# EAGLE schematic Lilypad buffered (EAGLE 6.1)
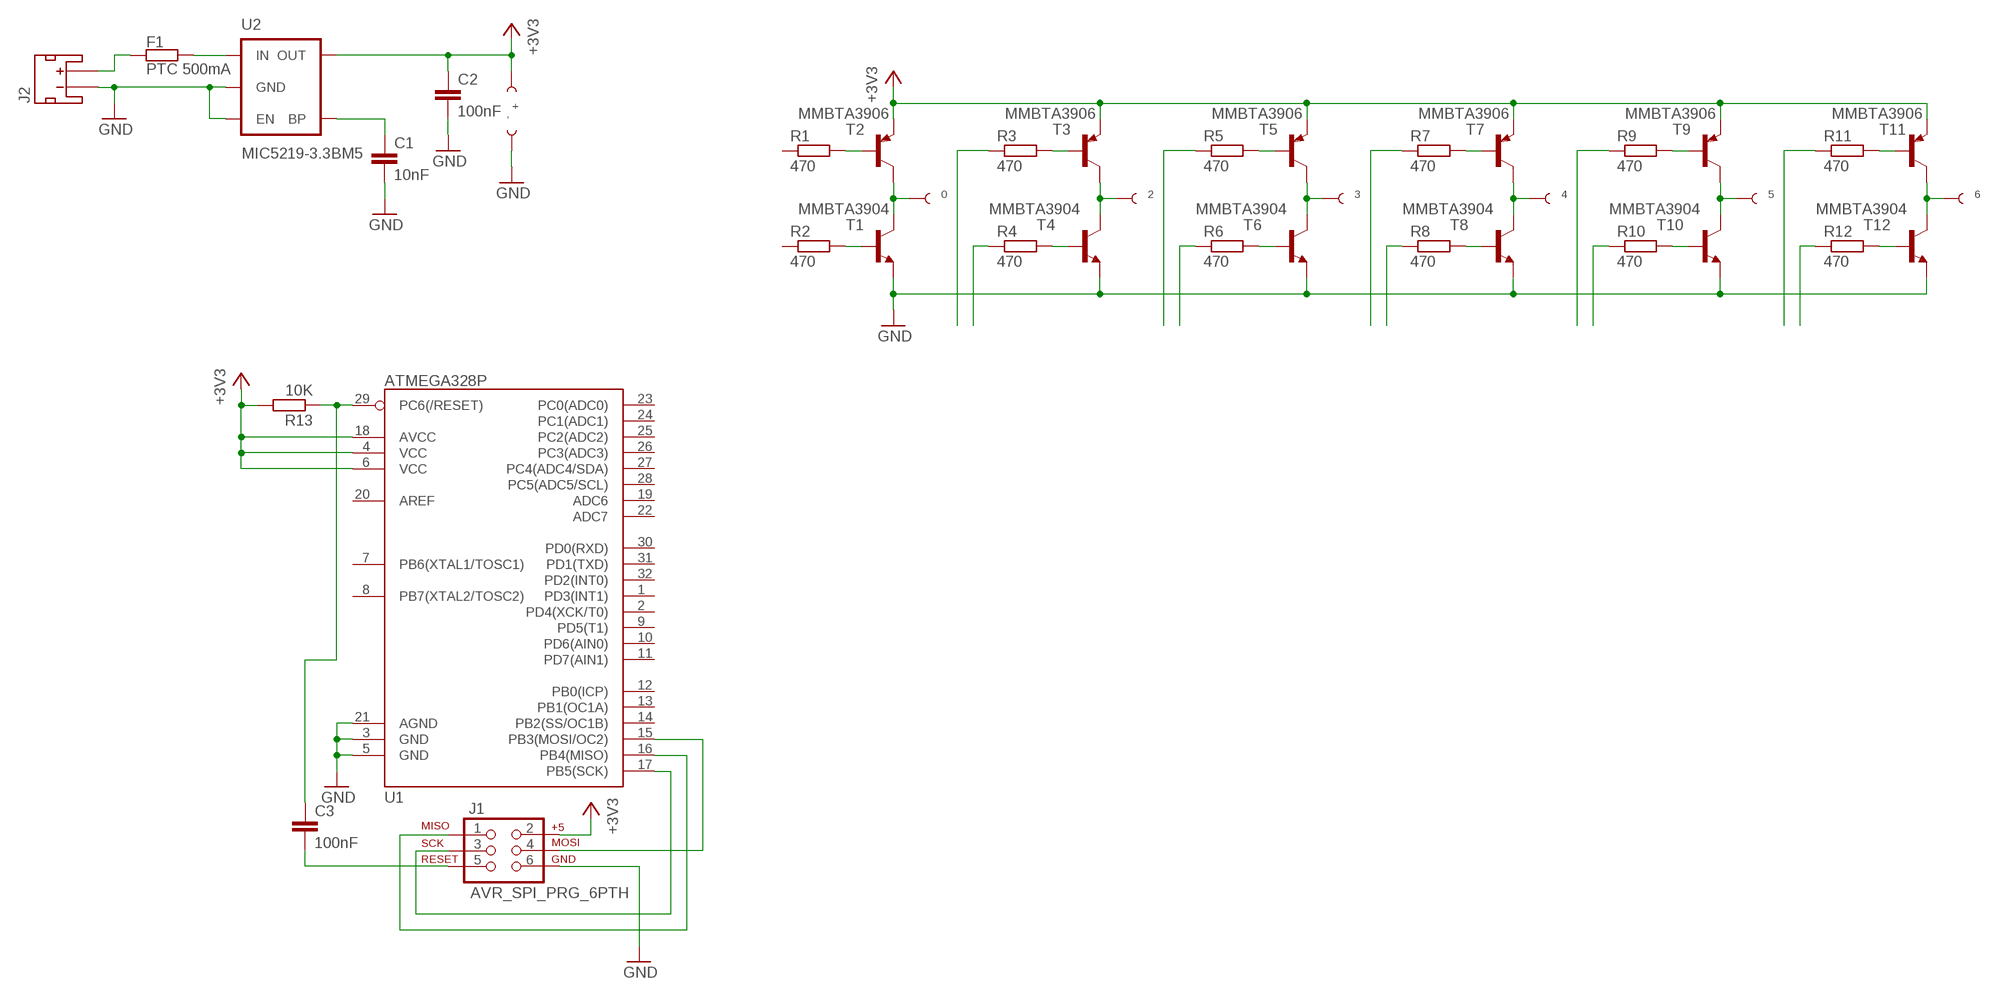
[diagram p0: schematic, sheet 1]

## Parts
C1  10nF  C-EUC0805K  [C0805K]
C2  100nF  C-EUC0805K  [C0805K]
C3  100nF  C-EUC0805K  [C0805K]
F1  PTC 500mA  RESISTENCIA-SMD-2012  [SMD-2012]
J1  AVR_SPI_PRG_6PTH  [2X3]
J2  JST_2MM_MALE  [JST-2-SMD]
R1  470  R-EU_R0603  [R0603]
R2  470  R-EU_R0603  [R0603]
R3  470  R-EU_R0603  [R0603]
R4  470  R-EU_R0603  [R0603]
R5  470  R-EU_R0603  [R0603]
R6  470  R-EU_R0603  [R0603]
R7  470  R-EU_R0603  [R0603]
R8  470  R-EU_R0603  [R0603]
R9  470  R-EU_R0603  [R0603]
R10  470  R-EU_R0603  [R0603]
R11  470  R-EU_R0603  [R0603]
R12  470  R-EU_R0603  [R0603]
R13  10K  R-EU_R0603  [R0603]
T1  MMBTA3904  MMBT3904LT1-NPN-SOT23-BEC  [SOT23-BEC]
T2  MMBTA3906  MMBT3906LT1-PNP-SOT23-BEC  [SOT23-BEC]
T3  MMBTA3906  MMBT3906LT1-PNP-SOT23-BEC  [SOT23-BEC]
T4  MMBTA3904  MMBT3904LT1-NPN-SOT23-BEC  [SOT23-BEC]
T5  MMBTA3906  MMBT3906LT1-PNP-SOT23-BEC  [SOT23-BEC]
T6  MMBTA3904  MMBT3904LT1-NPN-SOT23-BEC  [SOT23-BEC]
T7  MMBTA3906  MMBT3906LT1-PNP-SOT23-BEC  [SOT23-BEC]
T8  MMBTA3904  MMBT3904LT1-NPN-SOT23-BEC  [SOT23-BEC]
T9  MMBTA3906  MMBT3906LT1-PNP-SOT23-BEC  [SOT23-BEC]
T10  MMBTA3904  MMBT3904LT1-NPN-SOT23-BEC  [SOT23-BEC]
T11  MMBTA3906  MMBT3906LT1-PNP-SOT23-BEC  [SOT23-BEC]
T12  MMBTA3904  MMBT3904LT1-NPN-SOT23-BEC  [SOT23-BEC]
U1  ATMEGA328P  ATMEGA328_SMT  [TQFP32-08]
U2  MIC5219-3.3BM5  MIC52053.3V  [SOT23-5]
U$1  0  SEWTAP9  [PETAL-LONG-1-2SIDE]
U$2  2  SEWTAP9  [PETAL-LONG-1-2SIDE]
U$3  3  SEWTAP9  [PETAL-LONG-1-2SIDE]
U$4  4  SEWTAP9  [PETAL-LONG-1-2SIDE]
U$5  5  SEWTAP9  [PETAL-LONG-1-2SIDE]
U$6  6  SEWTAP9  [PETAL-LONG-1-2SIDE]
U$9  +  SEWTAP9  [PETAL-LONG-1-2SIDE]
U$10  -  SEWTAP9  [PETAL-LONG-1-2SIDE]

## Nets
+3V3: C2.1 J1.2 R13.2 T2.E T3.E T5.E T7.E T9.E T11.E U1.4(VCC) U1.6(VCC) U1.18(AVCC) U2.5(OUT) U$9.1
GND: C1.2 C2.2 J1.6 J2.1(-) T1.E T4.E T6.E T8.E T10.E T12.E U1.3(GND) U1.5(GND) U1.21(AGND) U2.2(GND) U2.3(EN) U$10.1
N$1: T1.C T2.C U$1.1
N$2: R1.2 T2.B
N$3: R2.2 T1.B
N$4: R4.2 T4.B
N$5: R3.2 T3.B
N$6: T3.C T4.C U$2.1
N$7: R3.1
N$8: R4.1
N$9: R6.2 T6.B
N$10: R5.2 T5.B
N$11: T5.C T6.C U$3.1
N$12: R5.1
N$13: R6.1
N$14: R8.2 T8.B
N$15: R7.2 T7.B
N$16: T7.C T8.C U$4.1
N$17: R7.1
N$18: R8.1
N$19: R10.2 T10.B
N$20: R9.2 T9.B
N$21: T9.C T10.C U$5.1
N$22: R9.1
N$23: R10.1
N$24: R12.2 T12.B
N$25: R11.2 T11.B
N$26: T11.C T12.C U$6.1
N$27: R11.1
N$28: R12.1
N$29: C1.1 U2.4(BP)
N$30: F1.P$2 J2.2(+)
N$31: J1.3 U1.17(PB5(SCK))
N$32: J1.1 U1.16(PB4(MISO))
N$33: J1.4 U1.15(PB3(MOSI/OC2))
N$34: C3.1 R13.1 U1.29(PC6(/RESET))
N$35: F1.P$1 U2.1(IN)
N$36: C3.2 J1.5
Unconnected: J2.NC1(PAD1) J2.NC2(PAD2) R1.1 R2.1 U1.1(PD3(INT1)) U1.2(PD4(XCK/T0)) U1.7(PB6(XTAL1/TOSC1)) U1.8(PB7(XTAL2/TOSC2)) U1.9(PD5(T1)) U1.10(PD6(AIN0)) U1.11(PD7(AIN1)) U1.12(PB0(ICP)) U1.13(PB1(OC1A)) U1.14(PB2(SS/OC1B)) U1.19(ADC6) U1.20(AREF) U1.22(ADC7) U1.23(PC0(ADC0)) U1.24(PC1(ADC1)) U1.25(PC2(ADC2)) U1.26(PC3(ADC3)) U1.27(PC4(ADC4/SDA)) U1.28(PC5(ADC5/SCL)) U1.30(PD0(RXD)) U1.31(PD1(TXD)) U1.32(PD2(INT0))

## Library data of the parts
C1-C3 = rcl:C-EU: CAPACITOR, European symbol
F1 = Personal - Varios:RESISTENCIA
J1 = SparkFun-Connectors:AVR_SPI_PRG_6: AVR ISP 6 Pin This is the reduced ISP connector for AVR programming. Common on Arduino. This footprint will take up less PCB space and can be used with a 10-pin to 6-pin adapter such as SKU: BOB-08508
J2 = SparkFun-Connectors:JST_2MM_MALE: Mates to single-cell LiPo batteries. CONN-08352; PROD_ID: CONN-08352
R1-R13 = resistor:R-EU_: RESISTOR, European symbol
T1 T4 T6 T8 T10 T12 = transistor-neu-to92:*-NPN-: NPN Transistror
T2 T3 T5 T7 T9 T11 = transistor:*-PNP-: PNP Transistror
U1 = SparkFun-DigitalIC:ATMEGA328_SMT: 32-Pin Atmega328 part Commonly used on Arduino compatible boards Available in QFP and QFN packages TQFP is IC-09069 QFN is non-stock; PROD_ID: IC-09069
U2 = SparkFun-PowerIC:MIC5205: MIC5205 150mA vreg 3.3V - VREG-00822 5V - VREG-00823; PROD_ID: VREG-00822
U$1-U$6 U$9 U$10 = LilyPad-Wearables:SEWTAP